# Altium project LA200-GZ.PrjPcb
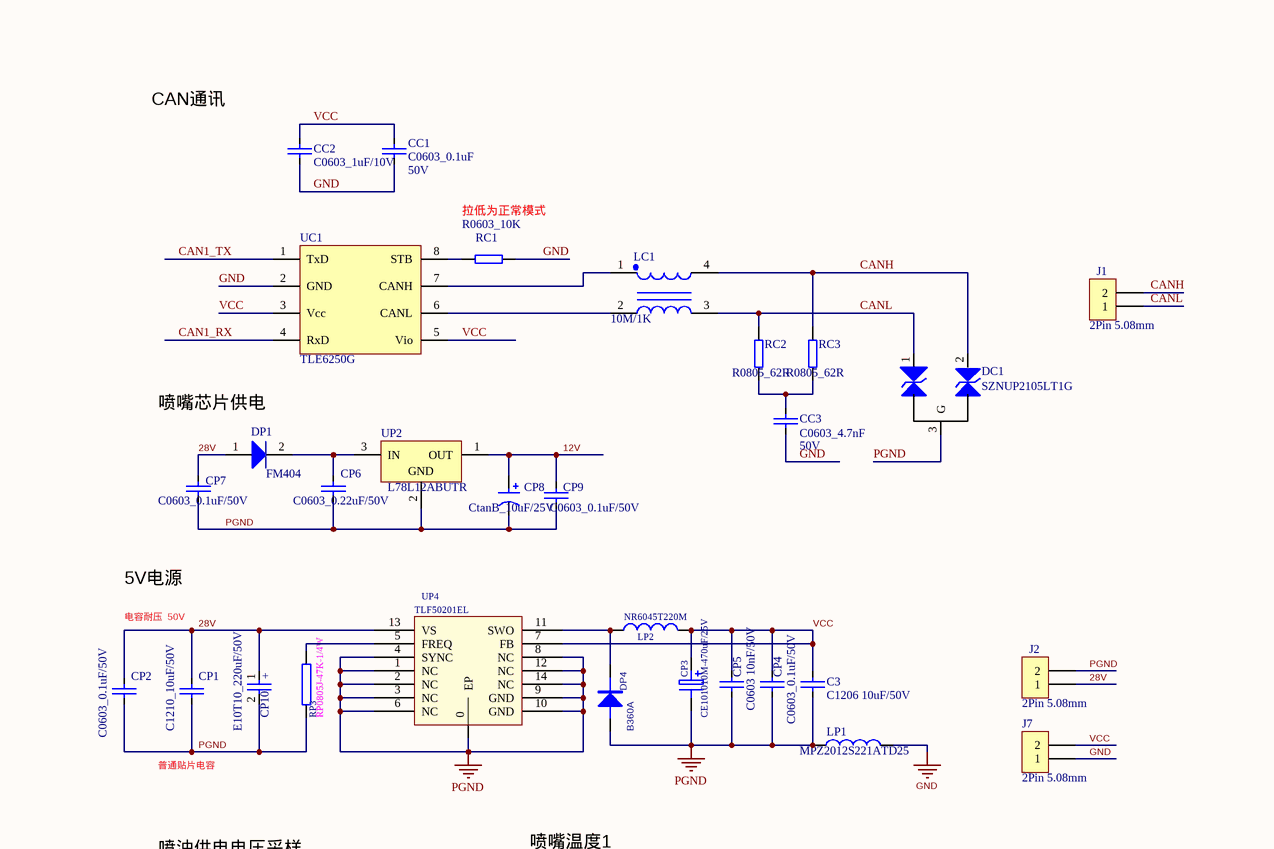
[diagram p0: LA200-GZ.SchDoc, top left]
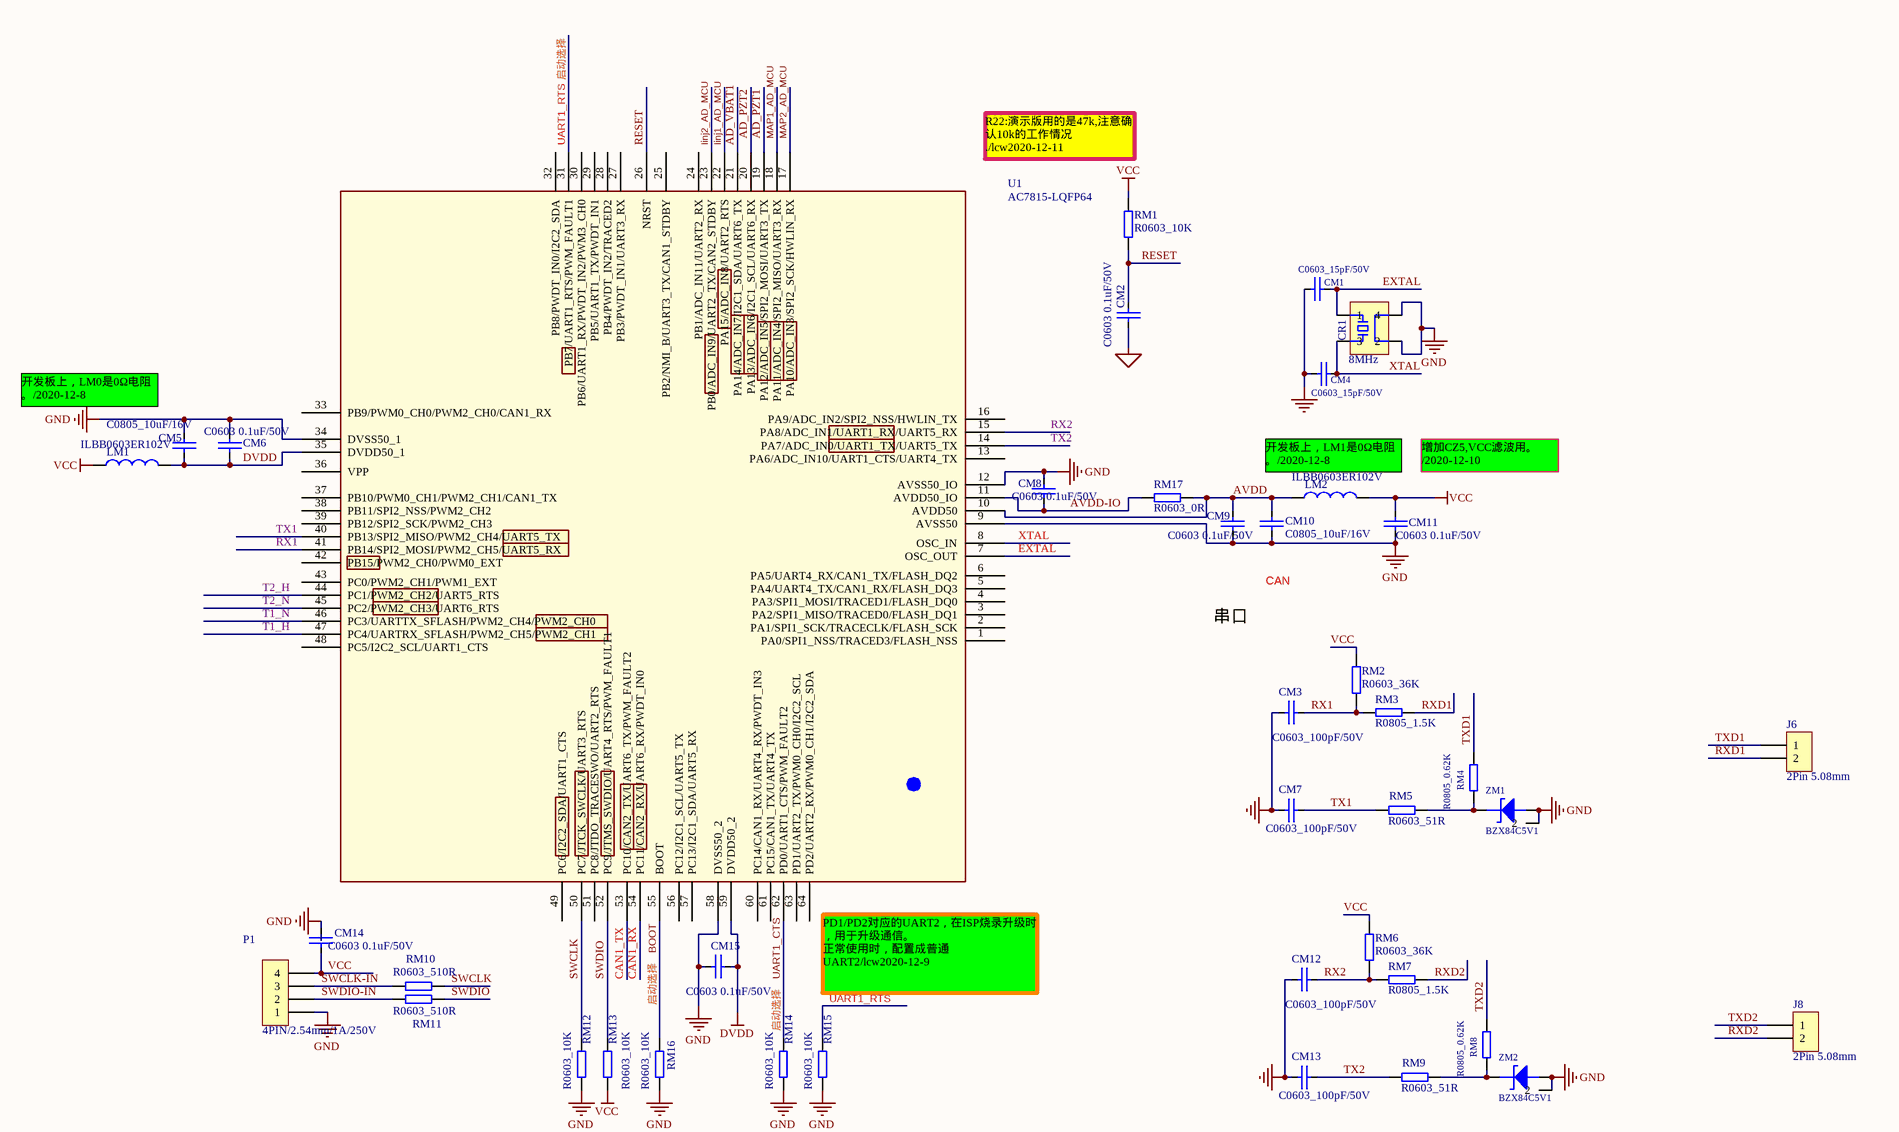
[diagram p1: LA200-GZ.SchDoc, top right]
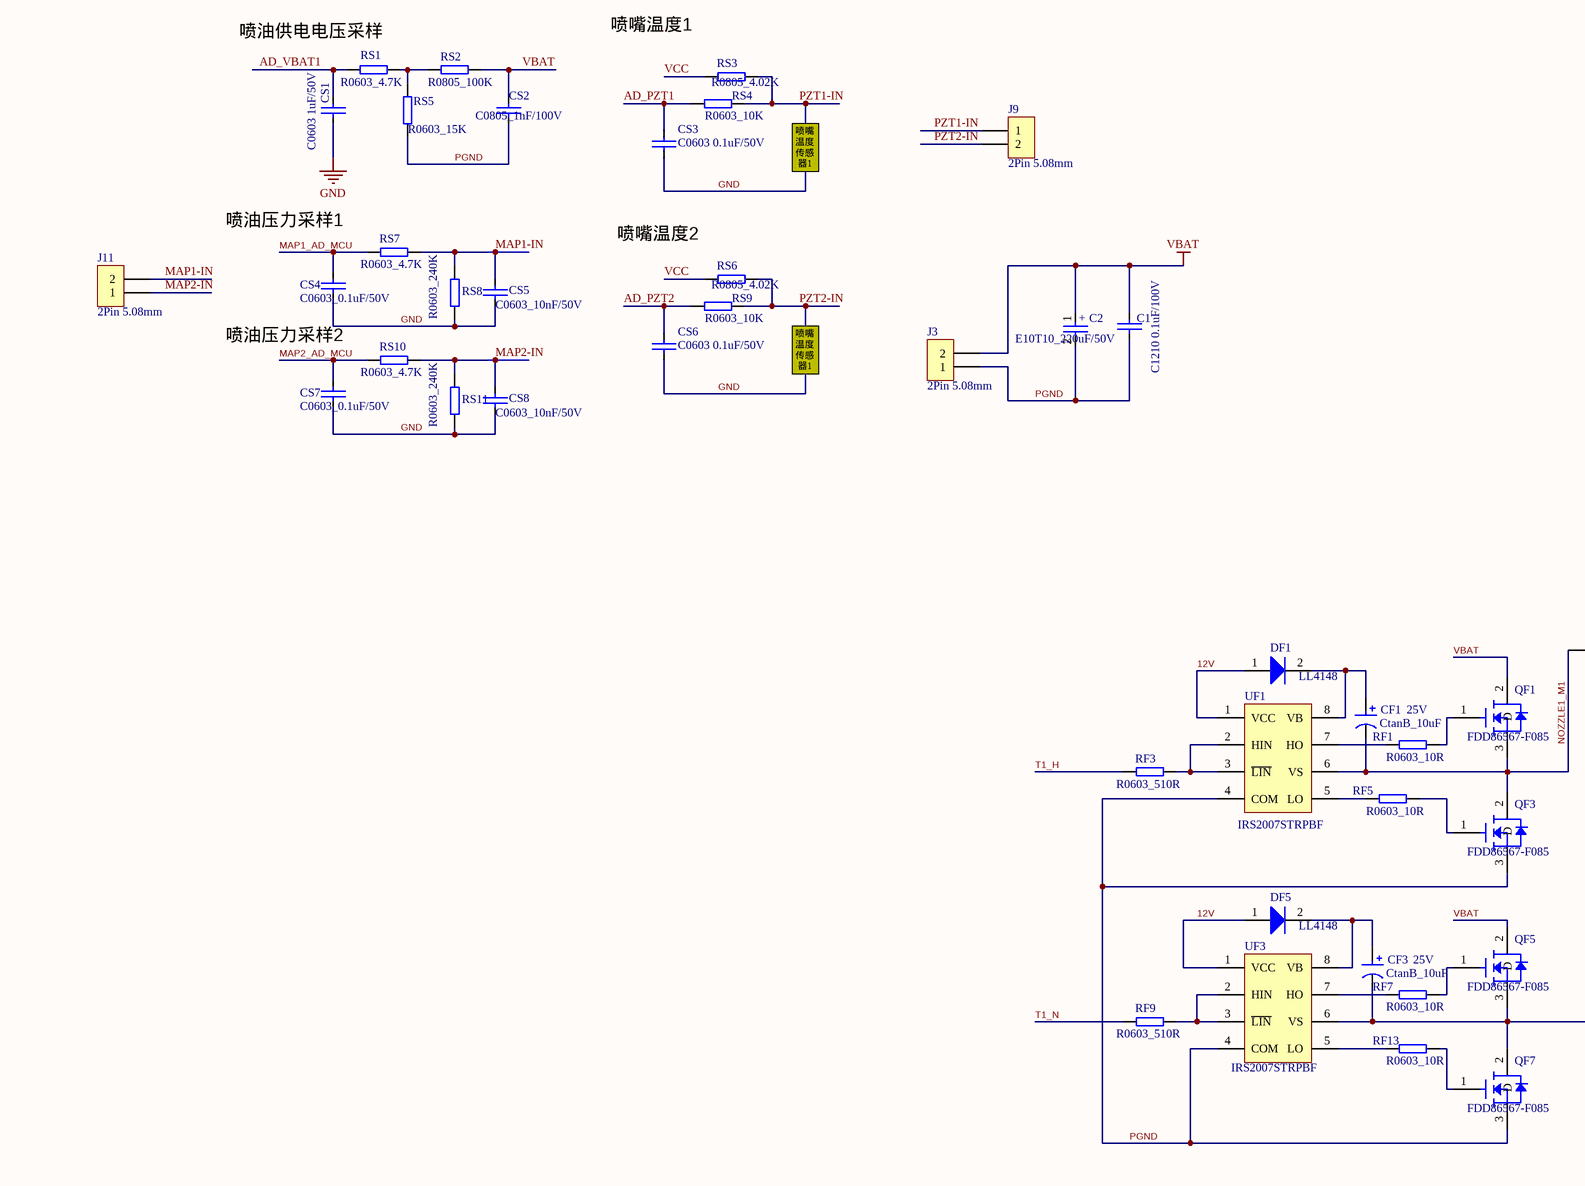
[diagram p2: LA200-GZ.SchDoc, bottom left]
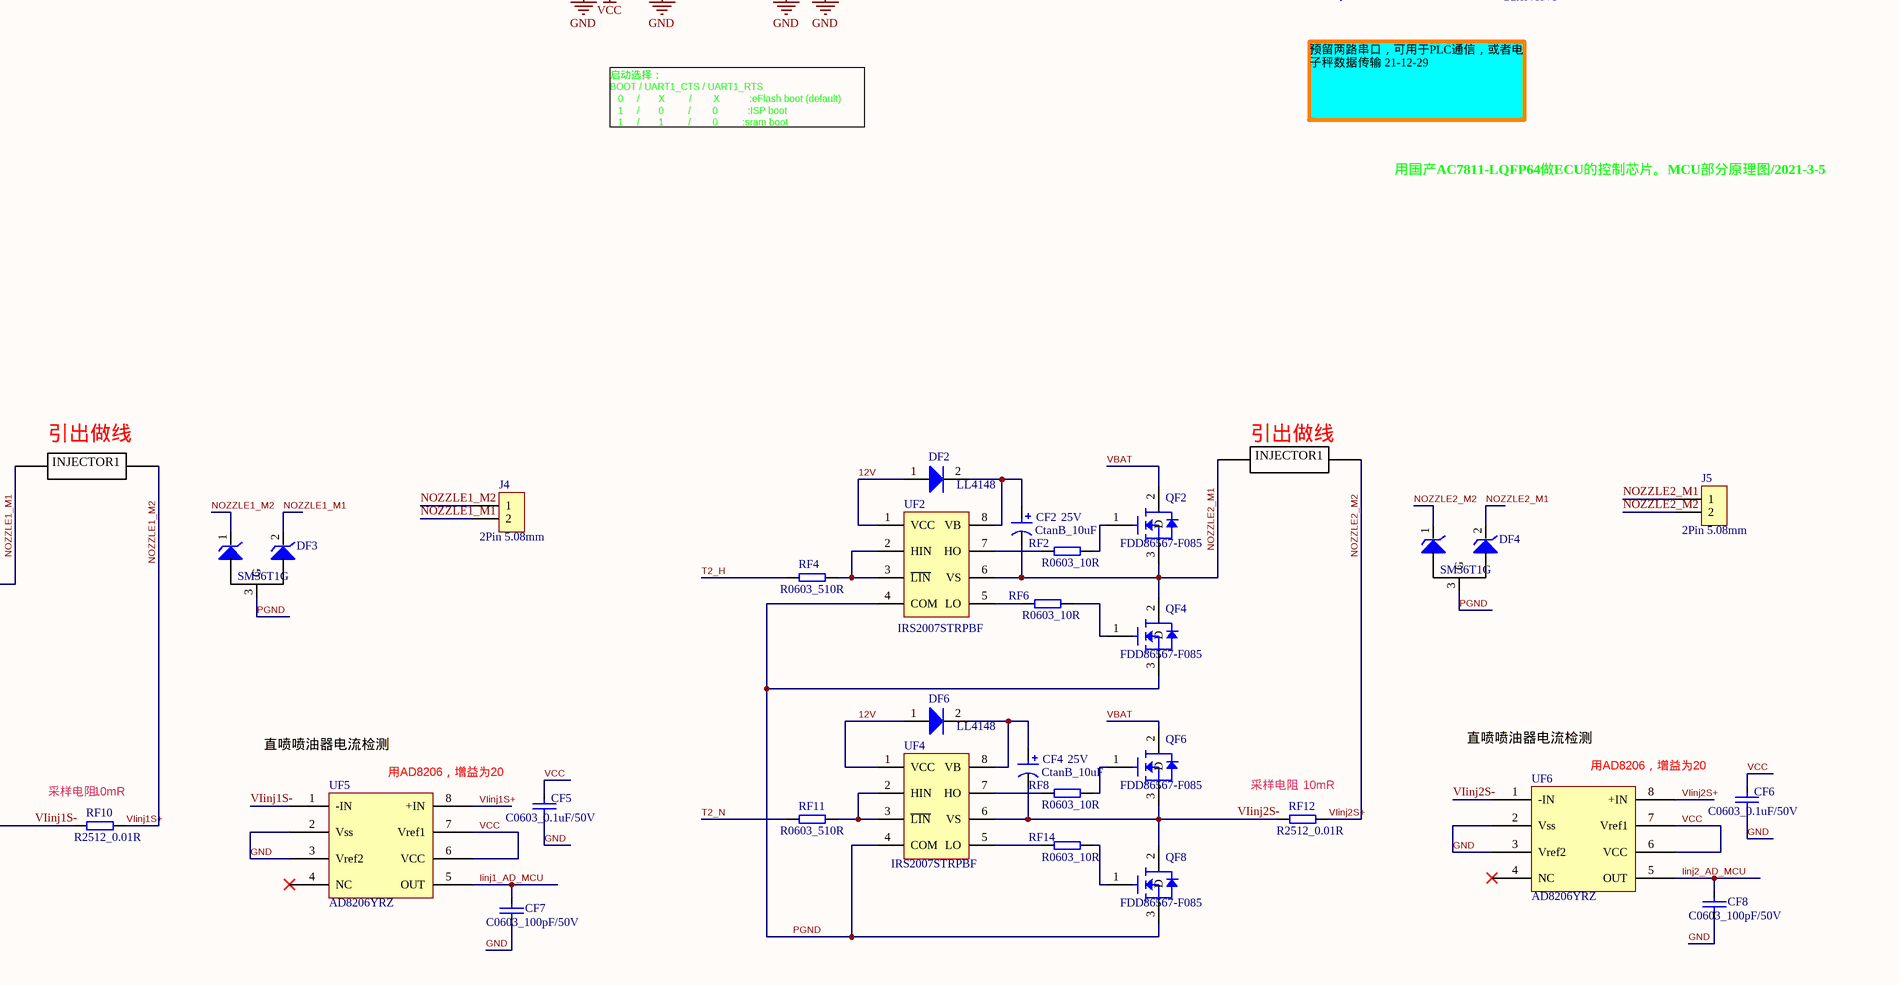
[diagram p3: LA200-GZ.SchDoc, bottom right]
1 sheet, 139 parts. Net scope: global (net labels, ports and power ports of the same name join across sheets).
Board file: LA200-GZ.PcbDoc

## Sheet LA200-GZ.SchDoc
size A1

### Parts
C1  C1210 0.1uF/100V  [C1210]
C2  E10T10_220uF/50V  [E10T10]
C3  C1206 10uF/50V  [C1206]
CC1  Voltage: 50V  [C0603]  (hidden comment: C0603_0.1uF)
CC2  C0603_1uF/10V  [C0603]
CC3  Voltage: 50V  [C0603]  (hidden comment: C0603_4.7nF)
CF1  Voltage: 25V  [CTANB]  (hidden comment: CtanB_10uF)
CF2  Voltage: 25V  [CTANB]  (hidden comment: CtanB_10uF)
CF3  Voltage: 25V  [CTANB]  (hidden comment: CtanB_10uF)
CF4  Voltage: 25V  [CTANB]  (hidden comment: CtanB_10uF)
CF5  C0603_0.1uF/50V  [C0603]
CF6  C0603_0.1uF/50V  [C0603]
CF7  C0603_100pF/50V  [C0603]
CF8  C0603_100pF/50V  [C0603]
CM1  C0603_15pF/50V  [C0603]
CM2  C0603 0.1uF/50V  [C0603]
CM3  C0603_100pF/50V  [C0603]
CM4  C0603_15pF/50V  [C0603]
CM5  C0805_10uF/16V  [C0805]
CM6  C0603 0.1uF/50V  [C0603]
CM7  C0603_100pF/50V  [C0603]
CM8  C0603 0.1uF/50V  [C0603]
CM9  C0603 0.1uF/50V  [C0603]
CM10  C0805_10uF/16V  [C0805]
CM11  C0603 0.1uF/50V  [C0603]
CM12  C0603_100pF/50V  [C0603]
CM13  C0603_100pF/50V  [C0603]
CM14  C0603 0.1uF/50V  [C0603]
CM15  C0603 0.1uF/50V  [C0603]
CP1  C1210_10uF/50V  [C1210]
CP2  C0603_0.1uF/50V  [C0603]
CP3  CE101010M-470uF/25V  [E10T10]
CP4  C0603_0.1uF/50V  [C0603]
CP5  C0603 10nF/50V  [C0603]
CP6  C0603_0.22uF/50V  [C0603]
CP7  C0603_0.1uF/50V  [C0603]
CP8  CtanB_10uF/25V  [CTANB]
CP9  C0603_0.1uF/50V  [C0603]
CP10  E10T10_220uF/50V  [E10T10]
CR1  8MHz  [5.0*3.2*0.9mm AB]
CS1  C0603 1uF/50V  [C0603]
CS2  C0805_1nF/100V  [C0805]
CS3  C0603 0.1uF/50V  [C0603]
CS4  C0603_0.1uF/50V  [C0603]
CS5  C0603_10nF/50V  [C0603]
CS6  C0603 0.1uF/50V  [C0603]
CS7  C0603_0.1uF/50V  [C0603]
CS8  C0603_10nF/50V  [C0603]
DC1  SZNUP2105LT1G  [SOT-23]
DF1  LL4148  [SOD-80]
DF2  LL4148  [SOD-80]
DF3  SM36T1G  [SOT-23]
DF4  SM36T1G  [SOT-23]
DF5  LL4148  [SOD-80]
DF6  LL4148  [SOD-80]
DP1  FM404  [D0-214AC]
DP4  B360A  [SMA-DIODE]
J1  2Pin 5.08mm  [CONN-TH_2P-P5.08_DB128L-5.08-2P]
J2  2Pin 5.08mm  [CONN-TH_2P-P5.08_DB128L-5.08-2P]
J3  2Pin 5.08mm  [CONN-TH_2P-P5.08_DB128L-5.08-2P]
J4  2Pin 5.08mm  [CONN-TH_2P-P5.08_DB128L-5.08-2P]
J5  2Pin 5.08mm  [CONN-TH_2P-P5.08_DB128L-5.08-2P]
J6  2Pin 5.08mm  [CONN-TH_2P-P5.08_DB128L-5.08-2P]
J7  2Pin 5.08mm  [CONN-TH_2P-P5.08_DB128L-5.08-2P]
J8  2Pin 5.08mm  [CONN-TH_2P-P5.08_DB128L-5.08-2P]
J9  2Pin 5.08mm  [CONN-TH_2P-P5.08_DB128L-5.08-2P]
J11  2Pin 5.08mm  [CONN-TH_2P-P5.08_DB128L-5.08-2P]
LC1  10M/1K  [ACT45B]
LM1  ILBB0603ER102V  [L0603]
LM2  ILBB0603ER102V  [L0603]
LP1  MPZ2012S221ATD25  [L 0805]
LP2  NR6045T220M  [L_6045]
P1  4PIN/2.54mm/1A/250V  [IDC-SIP-4P-2.54]
QF1  FDD86567-F085  [TO-252-3]
QF2  FDD86567-F085  [TO-252-3]
QF3  FDD86567-F085  [TO-252-3]
QF4  FDD86567-F085  [TO-252-3]
QF5  FDD86567-F085  [TO-252-3]
QF6  FDD86567-F085  [TO-252-3]
QF7  FDD86567-F085  [TO-252-3]
QF8  FDD86567-F085  [TO-252-3]
RC1  R0603_10K  [R0603]
RC2  R0805_62R  [R0805]
RC3  R0805_62R  [R0805]
RF1  R0603_10R  [R0603]
RF2  R0603_10R  [R0603]
RF3  R0603_510R  [R0603]
RF4  R0603_510R  [R0603]
RF5  R0603_10R  [R0603]
RF6  R0603_10R  [R0603]
RF7  R0603_10R  [R0603]
RF8  R0603_10R  [R0603]
RF9  R0603_510R  [R0603]
RF10  R2512_0.01R  [R2512]
RF11  R0603_510R  [R0603]
RF12  R2512_0.01R  [R2512]
RF13  R0603_10R  [R0603]
RF14  R0603_10R  [R0603]
RM1  R0603_10K  [R0603]
RM2  R0603_36K  [R0603]
RM3  R0805_1.5K  [R0805]
RM4  R0805_0.62K  [R0805]
RM5  R0603_51R  [R0603]
RM6  R0603_36K  [R0603]
RM7  R0805_1.5K  [R0805]
RM8  R0805_0.62K  [R0805]
RM9  R0603_51R  [R0603]
RM10  R0603_510R  [R0603]
RM11  R0603_510R  [R0603]
RM12  R0603_10K  [R0603]
RM13  R0603_10K  [R0603]
RM14  R0603_10K  [R0603]
RM15  R0603_10K  [R0603]
RM16  R0603_10K  [R0603]
RM17  R0603_0R  [R0603]
RP3  RP0805J-47K-1/4W  [0805_R]
RS1  R0603_4.7K  [R0603]
RS2  R0805_100K  [R0805]
RS3  R0805_4.02K  [R0805]
RS4  R0603_10K  [R0603]
RS5  R0603_15K  [R0603]
RS6  R0805_4.02K  [R0805]
RS7  R0603_4.7K  [R0603]
RS8  R0603_240K  [R0603]
RS9  R0603_10K  [R0603]
RS10  R0603_4.7K  [R0603]
RS11  R0603_240K  [R0603]
U1  AC7815-LQFP64  [LQFP-64_L10.0-W10.0-P0.50-LS12.0-BL-EP5.3]
UC1  TLE6250G  [PG-DSO-8]
UF1  IRS2007STRPBF  [SOIC-8L]
UF2  IRS2007STRPBF  [SOIC-8L]
UF3  IRS2007STRPBF  [SOIC-8L]
UF4  IRS2007STRPBF  [SOIC-8L]
UF5  AD8206YRZ  [SO-8_NB]
UF6  AD8206YRZ  [SO-8_NB]
UP2  L78L12ABUTR  [SOT-89]
UP4  TLF50201EL  [SSOP14-EP2]
ZM1  BZX84C5V1  [SOT-23AK]
ZM2  BZX84C5V1  [SOT-23AK]

### Nets
DVDD: CM5.2 CM6.1 CM15.2 LM1.2 U1.35(DVDD50_1) U1.59(DVDD50_2)
GND: CC1.2 CC2.1 CC3.2 CF5.2 CF6.2 CF7.2 CF8.2 CM1.2 CM2.1 CM3.1 CM4.2 CM5.1 CM6.2 CM7.1 CM8.1 CM9.2 CM10.2 CM11.2 CM12.1 CM13.1 CM14.1 CM15.1 CR1.2 CR1.4 CS1.2 CS3.2 CS4.2 CS5.2 CS6.2 CS7.2 CS8.2 J7.1 LP1.2 P1.1 RC1.2 RM12.1 RM14.1 RM15.1 RM16.1 RS8.1 RS11.1 U1.9(AVSS50) U1.12(AVSS50_IO) U1.34(DVSS50_1) U1.58(DVSS50_2) UC1.2(GND) UF5.2(Vss) UF5.3(Vref2) UF6.2(Vss) UF6.3(Vref2) ZM1.A ZM1.NC(2) ZM2.A ZM2.NC(2)
PGND: C1.2 C2.2 C3.2 CP1.2 CP2.2 CP3.2 CP4.2 CP5.2 CP6.2 CP7.2 CP8.2 CP9.2 CP10.2 CS2.2 DC1.3(G) DF3.3(G) DF4.3(G) DP4.A J2.2 J3.1 LP1.1 QF3.3(S) QF4.3(S) QF7.3(S) QF8.3(S) RP3.1 RS5.1 UF1.4(COM) UF2.4(COM) UF3.4(COM) UF4.4(COM) UP2.2(GND) UP4.0(EP) UP4.1(NC) UP4.2(NC) UP4.3(NC) UP4.4(SYNC) UP4.6(NC) UP4.8(NC) UP4.9(GND) UP4.10(GND) UP4.12(NC) UP4.14(NC)
VBAT: C1.1 C2.1 CS2.1 J3.2 QF1.2(D) QF2.2(D) QF5.2(D) QF6.2(D) RS2.2
VCC: C3.1 CC1.1 CC2.2 CF5.1 CF6.1 CM11.1 CM14.2 CP3.1 CP4.1 CP5.1 J7.2 LM1.1 LM2.2 LP2.2 P1.4 RM1.2 RM2.2 RM6.2 RM13.1 RS3.1 RS6.1 UC1.3(Vcc) UC1.5(Vio) UF5.6(VCC) UF5.7(Vref1) UF6.6(VCC) UF6.7(Vref1) UP4.7(FB)
12V: CP8.1 CP9.1 DF1.1 DF2.1 DF5.1 DF6.1 UF1.1(VCC) UF2.1(VCC) UF3.1(VCC) UF4.1(VCC) UP2.1(OUT)
28V: CP1.1 CP2.1 CP7.1 CP10.1 DP1.1 J2.1 UP4.13(VS)
AD_PZT1: CS3.1 RS4.1 U1.19(PA12/ADC_IN5/SPI2_MOSI/UART3_TX)
AD_PZT2: CS6.1 RS9.1 U1.20(PA13/ADC_IN6/I2C1_SCL/UART6_RX)
AD_VBAT1: CS1.1 RS1.1 U1.21(PA14/ADC_IN7/I2C1_SDA/UART6_TX)
AVDD: CM9.1 CM10.1 LM2.1 RM17.2 U1.10(AVDD50)
AVDD-IO: CM8.2 RM17.1 U1.11(AVDD50_IO)
BOOT: RM16.2 U1.55(BOOT)
CAN1_RX: U1.54(PC11/CAN2_RX/UART6_RX/PWDT_IN0) UC1.4(RxD)
CAN1_TX: U1.53(PC10/CAN2_TX/UART6_TX/PWM_FAULT2) UC1.1(TxD)
CANH: DC1.2 J1.2 LC1.4 RC3.2
CANL: DC1.1 J1.1 LC1.3 RC2.2
EXTAL: CM1.1 CR1.1 U1.7(OSC_OUT)
Iinj1_AD_MCU: CF7.1 U1.22(PA15/ADC_IN8/UART2_RTS) UF5.5(OUT)
Iinj2_AD_MCU: CF8.1 U1.23(PB0/ADC_IN9/UART2_TX/CAN2_STDBY) UF6.5(OUT)
MAP1-IN: CS5.1 J11.2 RS7.2 RS8.2
MAP1_AD_MCU: CS4.1 RS7.1 U1.18(PA11/ADC_IN4/SPI2_MISO/UART3_RX)
MAP2-IN: CS8.1 J11.1 RS10.2 RS11.2
MAP2_AD_MCU: CS7.1 RS10.1 U1.17(PA10/ADC_IN3/SPI2_SCK/HWLIN_RX)
NOZZLE1_M1: CF1.2 DF3.2 J4.2 QF1.3(S) QF3.2(D) UF1.6(VS)
NOZZLE1_M2: DF3.1 J4.1 RF10.2 UF5.8(+IN)  [also labelled VIinj1S+]
NOZZLE2_M1: CF2.2 DF4.2 J5.1 QF2.3(S) QF4.2(D) UF2.6(VS)
NOZZLE2_M2: DF4.1 J5.2 RF12.2 UF6.8(+IN)  [also labelled VIinj2S+]
PZT1-IN: J9.1 RS3.2 RS4.2
PZT2-IN: J9.2 RS6.2 RS9.2
RESET: CM2.2 RM1.1 U1.26(NRST)
RX1: CM3.2 RM2.1 RM3.1 U1.41(PB14/SPI2_MOSI/PWM2_CH5/UART5_RX)
RX2: CM12.2 RM6.1 RM7.1 U1.15(PA8/ADC_IN1/UART1_RX/UART5_RX)
RXD1: J6.2 RM3.2
RXD2: J8.2 RM7.2
SWCLK: RM10.2 RM12.2 U1.50(PC7/JTCK_SWCLK/UART3_RTS)
SWCLK-IN: P1.3 RM10.1
SWDIO: RM11.2 RM13.2 U1.52(PC9/JTMS_SWDIO/UART4_RTS/PWM_FAULT1)
SWDIO-IN: P1.2 RM11.1
T1_H: RF3.1 U1.47(PC4/UARTRX_SFLASH/PWM2_CH5/PWM2_CH1)
T1_N: RF9.1 U1.46(PC3/UARTTX_SFLASH/PWM2_CH4/PWM2_CH0)
T2_H: RF4.1 U1.44(PC1/PWM2_CH2/UART5_RTS)
T2_N: RF11.1 U1.45(PC2/PWM2_CH3/UART6_RTS)
TX1: CM7.2 RM5.1 U1.40(PB13/SPI2_MISO/PWM2_CH4/UART5_TX)
TX2: CM13.2 RM9.1 U1.14(PA7/ADC_IN0/UART1_TX/UART5_TX)
TXD1: J6.1 RM4.2
TXD2: J8.1 RM8.2
UART1_CTS: RM14.2 U1.62(PD0/UART1_CTS/PWM_FAULT2)
UART1_RTS: RM15.2 U1.31(PB7/UART1_RTS/PWM_FAULT1)
VIinj1S-: CF3.2 QF5.3(S) QF7.2(D) RF10.1 UF3.6(VS) UF5.1(-IN)
VIinj2S-: CF4.2 QF6.3(S) QF8.2(D) RF12.1 UF4.6(VS) UF6.1(-IN)
XTAL: CM4.1 CR1.3 U1.8(OSC_IN)
NetCC3_1: CC3.1 RC2.1 RC3.1
NetCF1_1: CF1.1 DF1.2 UF1.8(VB)
NetCF2_1: CF2.1 DF2.2 UF2.8(VB)
NetCF3_1: CF3.1 DF5.2 UF3.8(VB)
NetCF4_1: CF4.1 DF6.2 UF4.8(VB)
NetCP6_1: CP6.1 DP1.2 UP2.3(IN)
NetDP4_K: DP4.K LP2.1 UP4.11(SWO)
NetLC1_1: LC1.1 UC1.7(CANH)
NetLC1_2: LC1.2 UC1.6(CANL)
NetQF1_1: QF1.1 RF1.2
NetQF2_1: QF2.1 RF2.2
NetQF3_1: QF3.1 RF5.2
NetQF4_1: QF4.1 RF6.2
NetQF5_1: QF5.1 RF7.2
NetQF6_1: QF6.1 RF8.2
NetQF7_1: QF7.1 RF13.2
NetQF8_1: QF8.1 RF14.2
NetRC1_1: RC1.1 UC1.8(STB)
NetRF1_1: RF1.1 UF1.7(HO)
NetRF2_1: RF2.1 UF2.7(HO)
NetRF3_2: RF3.2 UF1.2(HIN) UF1.3(~{LIN})
NetRF4_2: RF4.2 UF2.2(HIN) UF2.3(~{LIN})
NetRF5_1: RF5.1 UF1.5(LO)
NetRF6_1: RF6.1 UF2.5(LO)
NetRF7_1: RF7.1 UF3.7(HO)
NetRF8_1: RF8.1 UF4.7(HO)
NetRF9_2: RF9.2 UF3.2(HIN) UF3.3(~{LIN})
NetRF11_2: RF11.2 UF4.2(HIN) UF4.3(~{LIN})
NetRF13_1: RF13.1 UF3.5(LO)
NetRF14_1: RF14.1 UF4.5(LO)
NetRM4_1: RM4.1 RM5.2 ZM1.K
NetRM8_1: RM8.1 RM9.2 ZM2.K
NetRP3_2: RP3.2 UP4.5(FREQ)
NetRS1_2: RS1.2 RS2.1 RS5.2

Not connected (* = marked no-connect by the designer): U1 1(PA0/SPI1_NSS/TRACED3/FLASH_NSS) 2(PA1/SPI1_SCK/TRACECLK/FLASH_SCK) 3(PA2/SPI1_MISO/TRACED0/FLASH_DQ1) 4(PA3/SPI1_MOSI/TRACED1/FLASH_DQ0) 5(PA4/UART4_TX/CAN1_RX/FLASH_DQ3) 6(PA5/UART4_RX/CAN1_TX/FLASH_DQ2) 13(PA6/ADC_IN10/UART1_CTS/UART4_TX) 16(PA9/ADC_IN2/SPI2_NSS/HWLIN_TX) 24(PB1/ADC_IN11/UART2_RX) 25(PB2/NMI_B/UART3_TX/CAN1_STDBY) 27(PB3/PWDT_IN1/UART3_RX) 28(PB4/PWDT_IN2/TRACED2) 29(PB5/UART1_TX/PWDT_IN1) 30(PB6/UART1_RX/PWDT_IN2/PWM3_CH0) 32(PB8/PWDT_IN0/I2C2_SDA) 33(PB9/PWM0_CH0/PWM2_CH0/CAN1_RX) 36(VPP) 37(PB10/PWM0_CH1/PWM2_CH1/CAN1_TX) 38(PB11/SPI2_NSS/PWM2_CH2) 39(PB12/SPI2_SCK/PWM2_CH3) 42(PB15/PWM2_CH0/PWM0_EXT) 43(PC0/PWM2_CH1/PWM1_EXT) 48(PC5/I2C2_SCL/UART1_CTS) 49(PC6/I2C2_SDA/UART1_CTS) 51(PC8/JTDO_TRACESWO/UART2_RTS) 56(PC12/I2C1_SCL/UART5_TX) 57(PC13/I2C1_SDA/UART5_RX) 60(PC14/CAN1_RX/UART4_RX/PWDT_IN3) 61(PC15/CAN1_TX/UART4_TX) 63(PD1/UART2_TX/PWM0_CH0/I2C2_SCL) 64(PD2/UART2_RX/PWM0_CH1/I2C2_SDA); UF5 4(NC)*; UF6 4(NC)*

### Notes on the sheet
- 启动选择
- R22:演示版用的是47k,注意确认10k的工作情况./lcw2020-12-11
- CAN通讯
- 拉低为正常模式
- 开发板上，LM0是0Ω电阻。/2020-12-8
- (near LM2) 开发板上，LM1是0Ω电阻。/2020-12-8
- 增加CZ5,VCC滤波用。/2020-12-10
- 喷嘴芯片供电
- CAN
- 串口
- 电容耐压  50V
- 5V电源
- 普通贴片电容
- 喷油供电电压采样
- 喷嘴温度1
- (near U1) PD1/PD2对应的UART2，在ISP烧录升级时，用于升级通信。
  正常使用时，配置成普通UART2/lcw2020-12-9
- (near RM14) 启动选择
- 喷嘴温度
  传感器1
- 喷油压力采样1
- 喷嘴温度2
- 喷油压力采样2
- 启动选择：
  BOOT / UART1_CTS / UART1_RTS
  0     /       X         /        X           :eFlash boot (default)
  1     /       0         /        0           :ISP boot
  1     /       1         /        0         :sram boot
  1     /       0        /         1        :serial flash boot
- 预留两路串口，可用于PLC通信，或者电子秤数据传输 21-12-29
- 用国产AC7811-LQFP64做ECU的控制芯片。MCU部分原理图/2021-3-5
- INJECTOR1
- 引出做线
- 直喷喷油器电流检测
- (near RF10) 采样电阻
- (near RF10) 10mR
- (near UF5) 用AD8206，增益为20
- (near RF12) 采样电阻
- (near RF12) 10mR
- (near UF6) 用AD8206，增益为20
- (in symbol 3172690040) +

### Library data of the parts
C1 = 3170014005: C1210 0.1uF/50V 10%; Part Number1: 03172540005; Manufacturer: YAGEO; Manufacture no: CC1210KRX7R9BB104; Voltage: 100V; Tolerance: 0.1; Type: 贴片电容; Part Number: 3170014005; Value: C1210 0.1uF/100V
C2 = 3172690040: E10T10 220uF/50V 20%; Part Number1: 03172690040; Manufacturer: LELON; Voltage: 50V; Tolerance: 0.2; Type: 铝电解电容; Part Number: 3172690040; Value: E10T10_220uF/50V
C3 = 3172530019: C1206 10uF/50V  10%; Part Number1: 03172530019; Manufacturer: YAGEO; Voltage: 50V; Tolerance: 0.1; Type: 贴片电容; Part Number: 3172530019; Value: C1206 10uF/50V
CC1 = 3170011015: C0603 0.1uF/50V 10%; Part Number1: 03172510014; Manufacturer: YAGEO; Manufacture no: CC0603KRX7R9BB104; Tolerance: 0.1; Part Number: 3170011015; Value: C0603_0.1uF; Price: 0.0079; Status: 凯而高; Type: 贴片电容
CC2 = 3170011015: C0603 0.1uF/50V 10%; Part Number1: 03172510014; Manufacturer: YAGEO; Manufacture no: CC0603KRX7R9BB104; Voltage: 10V; Tolerance: 0.1; Part Number: 3170011015; Value: C0603_1uF/10V; Price: 0.0079; Status: 凯而高; Type: 贴片电容
CC3 = 3170011009: C0603 4.7nF/50V 5% X7R; Part Number1: 03172410008; Manufacturer: YAGEO; Manufacture no: CC0603JRX7R9BB472; Tolerance: 0.1; Part Number: 3170011009; Value: C0603_4.7nF; Price: 0.012; Type: 贴片电容
CF1-CF4 = 3172690034: CtanB(1210) 10uF/25V 10%; Part Number1: 03172690034; Manufacturer: AVX; Manufacture no: TAJB106K025RNJ; Tolerance: 0.1; Part Number: 3172690034; Value: CtanB_10uF; Type: 钽电容
CF5 CF6 CM2 CM6 CM8 CM9 CM11 CM14 CM15 CP2 CP4 CP7 CP9 CS3 CS4 CS6 CS7 = 3170011015: C0603 0.1uF/50V 10%; Part Number1: 03172510014; Manufacturer: YAGEO; Manufacture no: CC0603KRX7R9BB104; Voltage: 50V; Tolerance: 0.1; Part Number: 3170011015; Price: 0.0079; Status: 凯而高; Type: 贴片电容
  CF5 CF6 CP2 CP4 CP7 CP9 CS4 CS7: Value: C0603_0.1uF/50V
  CM2 CM6 CM8 CM9 CM11 CM14 CM15 CS3 CS6: Value: C0603 0.1uF/50V
CF7 CF8 CM3 CM7 CM12 CM13 = 3170011003: C0603 100pF/50V 5%; Part Number1: 03172410002; Manufacturer: YAGEO/Fenghua; Manufacture no: CC0603JRNPO9BN101; Voltage: 50V; Tolerance: 0.05; Part Number: 3170011003; Value: C0603_100pF/50V; Price: 0.012; Type: 贴片电容
CM1 CM4 = 3172510040: C0603 15pF/50V 10%; Part Number1: 03172510040; Manufacturer: YAGEO; Voltage: 50V; Tolerance: 0.1; Part Number: 3172510040; Value: C0603_15pF/50V; Type: 贴片电容
CM5 CM10 = 3170012008: C0805 10uF/16V 10%; Part Number1: 03172520008; Manufacturer: YAGEO; Manufacture no: CC0805KRX5R7BB106; Voltage: 16V; Tolerance: 0.1; Part Number: 3170012008; Value: C0805_10uF/16V; Price: 0.012; Type: 贴片电容
CP1 = 3170014011: C1210 10uF/50V 10%; Part Number1: 03172540011; Manufacturer: murata; Manufacture no: GRM32ER71H106KA12L; Voltage: 50V; Tolerance: 0.1; Part Number: 3170014011; Value: C1210_10uF/50V; Type: 贴片电容
CP3 = ELECTRO1: 条形码: VEJ471M1ETR-1010; 物料编码: EPCA01006610
CP5 CS5 CS8 = 3170011011: C0603 10nF/50V  10%; Part Number1: 03172510010; Manufacturer: YAGEO; Manufacture no: CC0603KRX7R9BB103; Voltage: 50V; Tolerance: 0.1; Part Number: 3170011011; Price: 0.0058; Status: 凯而高; Type: 贴片电容
  CP5: Value: C0603 10nF/50V
  CS5 CS8: Value: C0603_10nF/50V
CP6 = 3172510028: C0603 0.22uF/50V 10%; Part Number1: 03172510028; Manufacturer: YAGEO; Voltage: 50V; Tolerance: 0.1; Part Number: 3172510028; Value: C0603_0.22uF/50V; Type: 贴片电容
CP8 = 3172690034: CtanB(1210) 10uF/25V 10%; Part Number1: 03172690034; Manufacturer: AVX; Manufacture no: TAJB106K025RNJ; Voltage: 25V; Tolerance: 0.1; Part Number: 3172690034; Value: CtanB_10uF/25V; Type: 钽电容
CP10 = 3172690040: E10T10 220uF/50V 20%; Part Number1: 03172690040; Manufacturer: LELON; Voltage: 50V; Tolerance: 0.2; Part Number: 3172690040; Value: E10T10_220uF/50V; Type: 铝电解电容
CR1 = 53120010024: 5.0*3.2*0.9mm AB 8MHz; Manufacturer: TXC; Type: 晶振; Part Number: 53120010024; Part Number1: 53120010024; Manufacture no: 8MHz; Value: 8MHz; Status: Active
CS1 = 3172510036: C0603 1uF/50V 10%; Part Number1: 03172510036; Manufacturer: YAGEO; Voltage: 50V; Tolerance: 0.1; Part Number: 3172510036; Value: C0603 1uF/50V; Type: 贴片电容
CS2 = 3172520028: C0805 1nF/100V 10%; Part Number1: 03172520028; Manufacturer: YAGEO; Voltage: 100V; Tolerance: 0.1; Part Number: 3172520028; Value: C0805_1nF/100V; Type: 贴片电容
DC1 = 3110050073: SOT-23 SZNUP2105LT1G; Part Number1: 03110050073; Manufacturer: ON; ProductNumber: GSOT08C/Vishay; Voltage: 24V; Power: 350W; Part Number: 3110050073; Manufacture no: SZNUP2105LT1G; Value: SZNUP2105LT1G; Status: Active; Type: CAN保护TVS
DF1 DF2 DF5 DF6 = 3110010015: SOD-80  LL4148 2A/75V; Part Number1: 03110010015; Manufacturer: VISHA; Current: 2A; Voltage: 75V; Part Number: 3110010015; Manufacture no: LL4148; Value: LL4148; Status: Active; Type: SWH DIODE
DF3 DF4 = 3110050074: SOT-23 SM36T1G; Part Number1: 03110050074; Manufacturer: ON; ProductNumber: GSOT08C/Vishay; Voltage: 36V; Power: 300W; Part Number: 3110050074; Manufacture no: SM36T1G; Value: SM36T1G; Status: Active; Type: TVS
DP1 = 13110010013: D0-214AC FM404; Part Number1: 53110010013; Manufacturer: LRC; Current: 1A; Voltage: 400V; Part Number: 13110010013; Manufacture no: FM404; Value: FM404; Status: Active; Type: 二极管
DP4 = DIODE: 60V,1A,肖特基二极管
J1-J9 J11 = 31900010141: 691311500002 2Pin 5.08mm 公头; Part Number1: 53190010141; Manufacturer: WE; Part Number: 31900010141; Manufacture no: 691311500002 2Pin 5.08mm; Value: 2Pin 5.08mm; Status: Active; Type: 接插件
LC1 = 3180020022: ACT45B-510-2P-TL  10M/1K/0.2A; Part Number1: 03180020022; Manufacturer: TDK; Current: 0.2A; Tolerance: 20%; DCR: 1R; Part Number: 3180020022; Manufacture no: ACT45B-510-2P-TL; Value: 10M/1K; Status: Active; Type: SIGNAL COMMON INDUCTOR
LM1 LM2 = 3180020002: L0603 ILBB0603ER102V; Part Number1: 03180020002; Manufacturer: Vishay; Current: 0.1A; Tolerance: 100M/1K; DCR: 0.6R; Part Number: 3180020002; Manufacture no: ILBB0603ER102V; Value: ILBB0603ER102V; Status: Active; Type: 磁珠
LP1 = 53180020011: L0805 MPZ2012S221ATD25; Manufacturer: TDK; Current: 3A; Tolerance: 25%; DCR: 0.04Ω; Part Number: 53180020011; Part Number1: 53180020011; Manufacture no: MPZ2012S221ATD25; Value: MPZ2012S221ATD25; Type: INDUCTOR
LP2 = Inductor: 22uH/1.9A; 条形码: YKNR6045-220; 物料编码: EPLA03000310
P1 = 3190010008: 直针插座 CWF25404D180 4PIN/2.54mm/1A/250V; Part Number1: 03190010008; Manufacturer: CSCONN 德科泰; Part Number: 3190010008; Manufacture no: CWF25404D180; Value: 4PIN/2.54mm/1A/250V; Status: Active; Type: 接插件
QF1-QF8 = 53110022012: TO-252-3 FDD86567-F085 60V/100A; Manufacturer: ON; Current: 100A; Voltage: 60V; DCR: 3.2mR; Part Number: 53110022012; Part Number1: 53110022012; Manufacture no: FDD86567-F085; Value: FDD86567-F085; Status: Active; Type: FET-N
RC1 RM12-RM16 = 3160030053: R0603 1/10w 10K 1%; Part Number1: 03162310053; Manufacturer: YAGEO; Manufacture no: RC0603FR-0710KL; Tolerance: 0.01; Part Number: 3160030053; Value: R0603_10K; Power: 1/10w; Unit Price: 0.0054; Status: 杭州，晶电; Type: 贴片电阻
RC2 RC3 = 3160050016: R0805 1/8w10R 1%; Part Number1: 03162320016; Manufacturer: YAGEO; Manufacture no: RC0805FR-0710RL; Power: 1/8w; Tolerance: 0.01; Part Number: 3160050016; Value: R0805_62R; Type: 贴片电阻
RF1 RF2 RF5-RF8 RF13 RF14 = 3160030193: R0603 1/10w  10R 1%; Part Number1: 03162310193; Manufacturer: YAGEO; Manufacture no: RC0603FR-0710RL; Tolerance: 0.01; Part Number: 3160030193; Value: R0603_10R; Power: 1/10w; Type: 贴片电阻
RF3 RF4 RF9 RF11 RM10 RM11 = 3160030020: R0603  1/10w 510R 1%; Part Number1: 03162310020; Manufacturer: YAGEO; Manufacture no: RC0603FR-07510RL; Tolerance: 0.01; Part Number: 3160030020; Value: R0603_510R; Power: 1/10w; Unit Price: 0.0054; Type: 贴片电阻
RF10 RF12 = 3162380033: R2512 1W 0.01R 1%; Part Number1: 03162380033; Manufacturer: YAGEO; Tolerance: 0.01; Part Number: 3162380033; Value: R2512_0.01R; Power: 1W; Type: 贴片电阻
RM1 RS4 RS9 = 3160030053: R0603 1/10w 10K; Part Number1: 03162310053; Manufacturer: YAGEO; Manufacture no: RC0603FR-0710KL; Tolerance: 0.01; Part Number: 3160030053; Value: R0603_10K; Power: 1/10w; Unit Price: 0.0054; Status: 杭州，晶电; Type: 贴片电阻
RM2 RM6 = 3160030087: R0603 1/10w  36K 1%; Part Number1: 03162310087; Manufacturer: YAGEO; Manufacture no: RC0603FR-0736KL; Tolerance: 0.01; Part Number: 3160030087; Value: R0603_36K; Power: 1/10w; Unit Price: 0.0054; Type: 贴片电阻
RM3 RM7 = 13162320038: R0805 1/8w 1.5K 1%最好用1/4w; Manufacturer: YAGEO; Tolerance: 0.01; Part Number: 13162320038; Part Number1: 13162320038; Value: R0805_1.5K; Power: 1/8w; Unit Price: 0.0085; Type: 贴片电阻
RM4 RM8 = 3162320027: R0805 1/8w 0.62K 1% 需要1/4w; Part Number1: 03162320027; Manufacturer: YAGEO; Manufacture no: RC0805FR-076K2L; Tolerance: 0.01; Part Number: 3162320027; Value: R0805_0.62K; Power: 1/8w; Type: 贴片电阻
RM5 RM9 = 3160030013: R0603  1/10w 51R 1%或100欧; Part Number1: 03162310013; Manufacturer: YAGEO; Manufacture no: RC0603FR-0751RL; Tolerance: 0.01; Part Number: 3160030013; Value: R0603_51R; Power: 1/10w; Unit Price: 0.0054; Type: 贴片电阻
RM17 = 3160030001: R0603 1/10w 0R 1%; Part Number1: 03162310001; Manufacturer: YAGEO/UNIOHM; Manufacture no: RC0603FR-070RL; Tolerance: 0.01; Part Number: 3160030001; Value: R0603_0R; Power: 1/10w; Unit Price: 0.0054; Type: 贴片电阻
RP3 = RES2: 汽车级电阻，47kΩ; 条形码: 30PRC0805JR-7W47K; 物料编码: EPRA03010210
RS1 RS7 RS10 = 3160030224: R0603 1/10w  4.7K 1%; Part Number1: 03162310224; Manufacturer: YAGEO; Manufacture no: RC0603FR-074K7L; Tolerance: 0.01; Part Number: 3160030224; Value: R0603_4.7K; Power: 1/10w; Type: 贴片电阻
RS2 = 3160050008: R0805 1/8w 100K 1%; Part Number1: 03162320008; Manufacturer: YAGEO; Manufacture no: RC0805FR-07100KL; Tolerance: 0.01; Part Number: 3160050008; Value: R0805_100K; Power: 1/8w; Type: 贴片电阻
RS3 RS6 = 13162320037: R0805 1/8w 4.02K 1%; Manufacturer: YAGEO; Tolerance: 0.01; Part Number: 13162320037; Part Number1: 13162320037; Value: R0805_4.02K; Power: 1/8w; Unit Price: 0.0085; Type: 贴片电阻
RS5 = 3160030062: R0603 1/10w 15K 1%; Part Number1: 03162310062; Manufacturer: YAGEO; Manufacture no: RC0603FR-0715KL; Tolerance: 0.01; Part Number: 3160030062; Value: R0603_15K; Power: 1/10w; Unit Price: 0.0054; Type: 贴片电阻
RS8 RS11 = 3160030151: R0603 1/10w 240K 1%; Part Number1: 03162310151; Manufacturer: YAGEO; Manufacture no: RC0603FR-07240KL; Tolerance: 0.01; Part Number: 3160030151; Value: R0603_240K; Power: 1/10w; Unit Price: 0.0054; Type: 贴片电阻
U1 = AC7811-LQFP64
UC1 = 3100050124: PG-DSO-8 TLE9251VSJ; Part Number1: 03100050124; Manufacturer: infineon; Part Number: 3100050124; Manufacture no: TLE9251VSJ; Value: TLE6250G; Type: CAN芯片
UF1-UF4 = 3100050121: SOIC-8L IRS2007STRPBF; Part Number1: 03100050121; Manufacturer: infineon; Part Number: 3100050121; Manufacture no: IRS2007STRPBF; Value: IRS2007STRPBF; Type: 半桥驱动芯片
UF5 UF6 = 3100100010: SO-8_NB AD8206YRZ; Part Number1: 03100100010; Manufacturer: ADI; Part Number: 3100100010; Manufacture no: AD8206YRZ; Value: AD8206YRZ; Price: 18; Status: Active; Type: 差分放大器
UP2 = 3100050105: SOT-89 L78L12ABUTR; Part Number1: 03100050105; Manufacturer: ST; Part Number: 3100050105; Manufacture no: L78L12ABUTR; Value: L78L12ABUTR; Type: LDO芯片
UP4 = TLF50201EL: 物料编码: EPIA00000002; 条形码: *
ZM1 ZM2 = 3110010088: SOT-23 BZX84C5V1; Part Number1: 13110040088; Manufacturer: ON; Voltage: 225mW; Power: 5.1V; Part Number: 3110010088; Manufacture no: BZX84C5V1; Value: BZX84C5V1; Status: Active; Type: Zener